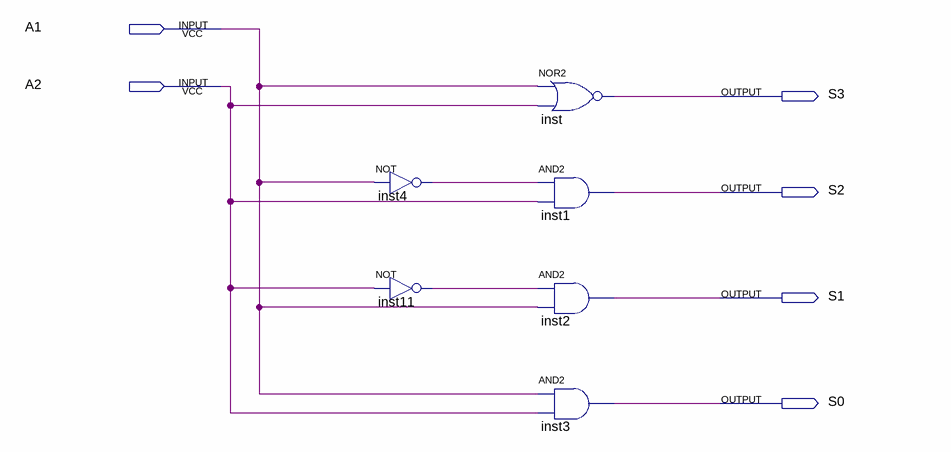
[diagram p0: schematic sheet]
// Quartus schematic EsquemaEletrico.bdf as structural Verilog: 6 symbols, 6 pins
module EsquemaEletrico (
  input  A1,
  input  A2,
  output S3,
  output S2,
  output S1,
  output S0
);

  wire inst4_out, inst11_out;

  not inst4 (inst4_out, A1);
  not inst11 (inst11_out, A2);
  nor inst (S3, A1, A2);
  and inst1 (S2, inst4_out, A2);
  and inst2 (S1, inst11_out, A1);
  and inst3 (S0, A1, A2);
endmodule
